# Altium schematic sheet schematic.SchDoc
size A4; SheetNumber: 1; SheetTotal: 1
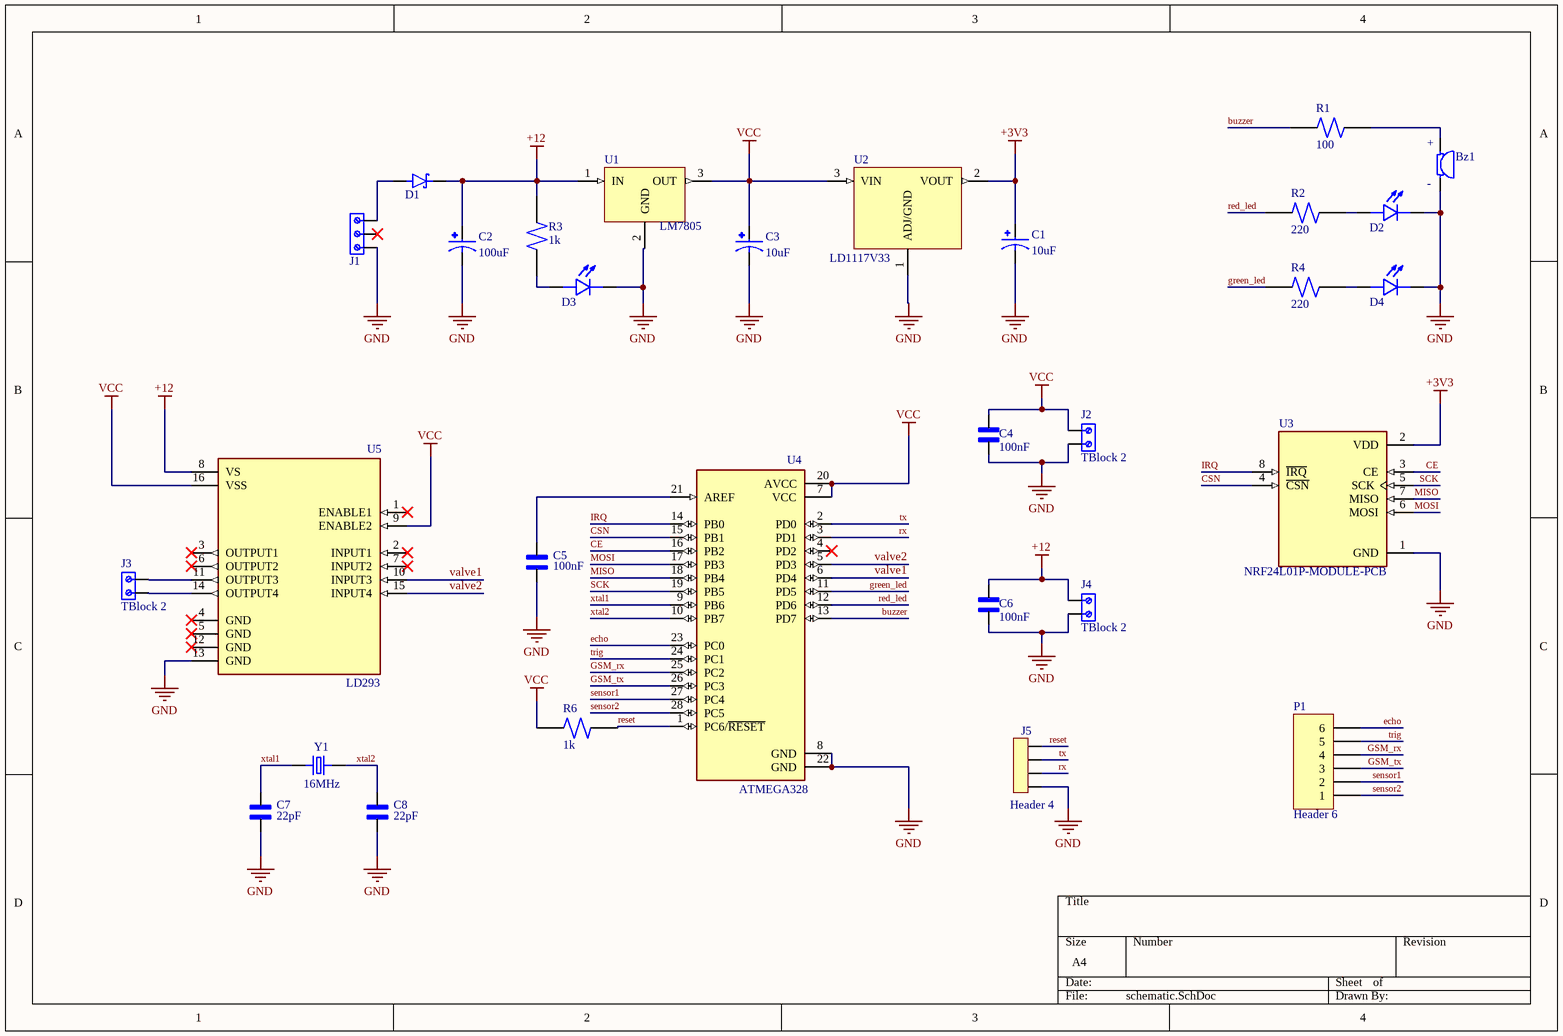
[diagram p0: schematic.SchDoc]

## Parts
Bz1  AI-1223-TWT-12V-R  [XDCR_AI-1223-TWT-12V-R]  (value not drawn)
C1  10uF  [CAPPRD500W50D500H1100]
C2  100uF  [CAPPRD500W50D500H1100]
C3  10uF  [CAPPRD500W50D500H1100]
C4  100nF  [CAPRB500W50L450T300H550]
C5  100nF  [CAPRB500W50L450T300H550]
C6  100nF  [CAPRB500W50L450T300H550]
C7  22pF  [CAPRB500W50L450T300H550]
C8  22pF  [CAPRB500W50L450T300H550]
D1  1N5404  [DIOAD1990W125L900D530]  (value not drawn)
D2  L08R5000Q1  [LEDRD254W57D500H1070]  (value not drawn)
D3  L08R5000Q1  [LEDRD254W57D500H1070]  (value not drawn)
D4  L08R5000Q1  [LEDRD254W57D500H1070]  (value not drawn)
J1  691214110003  [691214110003]  (value not drawn)
J2  TBlock 2  [691111710002]
J3  TBlock 2  [691111710002]
J4  TBlock 2  [691111710002]
J5  Header 4  [SULLINS_PPTC041LFBN-RC]
P1  Header 6  [HDR1X6]
R1  100  [RESAD1100W55L680D260]
R2  220  [RESAD1100W55L680D260]
R3  1k  [RESAD1100W55L680D260]
R4  220  [RESAD1100W55L680D260]
R6  1k  [RESAD1100W55L680D260]
U1  LM7805  [TO254P1054X470X1955-3]
U2  LD1117V33  [TO255P1020X450X1968-3]
U3  NRF24L01P-MODULE-PCB  [XCVR_NRF24L01P-MODULE-PCB]
U4  ATMEGA328  [DIP794W46P254L2967H457Q28B]
U5  LD293  [DIP880W50P254L2000H510Q16]
Y1  16MHz  [XTAL_ECS-160-20-4X]

## Nets
+3V3: C1.P U2.2(VOUT) U3.2(VDD)
+12: C2.P C6.2 D1.C(K) J4.2 R3.2 U1.1(IN) U5.8(VS)
GND: Bz1.N(NEG) C1.N C2.N C3.N C4.1 C5.1 C6.1 C7.1 C8.1 D2.C D3.C D4.C J1.1 J2.1 J4.1 J5.4 U1.2(GND) U2.1(ADJ/GND) U3.1(GND) U4.8(GND) U4.22(GND) U5.13(GND)
VCC: C3.P C4.2 J2.2 R6.2 U1.3(OUT) U2.3(VIN) U4.7(VCC) U4.20(AVCC) U5.9(ENABLE2) U5.16(VSS)
buzzer: R1.2 U4.13(PD7)
CE: U3.3(CE) U4.16(PB2)
CSN: U3.4(~{CSN}) U4.15(PB1)
echo: P1.6 U4.23(PC0)
green_led: R4.2 U4.11(PD5)
GSM_rx: P1.4 U4.25(PC2)
GSM_tx: P1.3 U4.26(PC3)
IRQ: U3.8(~{IRQ}) U4.14(PB0)
MISO: U3.7(MISO) U4.18(PB4)
MOSI: U3.6(MOSI) U4.17(PB3)
red_led: R2.2 U4.12(PD6)
reset: J5.1 R6.1 U4.1(PC6/~{RESET})
rx: J5.3 U4.3(PD1)
SCK: U3.5(SCK) U4.19(PB5)
sensor1: P1.2 U4.27(PC4)
sensor2: P1.1 U4.28(PC5)
trig: P1.5 U4.24(PC1)
tx: J5.2 U4.2(PD0)
valve1: U4.6(PD4) U5.10(INPUT3)
valve2: U4.5(PD3) U5.15(INPUT4)
xtal1: C7.2 U4.9(PB6) Y1.1
xtal2: C8.2 U4.10(PB7) Y1.2
NetBz1_P: Bz1.P(POS) R1.1
NetC5_2: C5.2 U4.21(AREF)
NetD1_A: D1.A J1.3
NetD2_A: D2.A R2.1
NetD3_A: D3.A R3.1
NetD4_A: D4.A R4.1
NetJ3_1: J3.1 U5.11(OUTPUT3)
NetJ3_2: J3.2 U5.14(OUTPUT4)

Not connected (* = marked no-connect by the designer): J1 2*; U4 4(PD2)*; U5 1(ENABLE1)* 2(INPUT1)* 3(OUTPUT1)* 4(GND)* 5(GND)* 6(OUTPUT2)* 7(INPUT2)* 12(GND)*

## Notes on the sheet
- (in symbol Buzzer) +; -

## Library data of the parts
Bz1 = Buzzer: ELECTRO-MECHANICAL AUDIO INDICATOR; MF: PUI Audio,; Availability: In Stock; Package: 2225 PUI Audio; Value: *; Price: None; MP: AI-1223-TWT-12V-R; Purchase-URL: https://pricing.snapeda.com/search/part/AI-1223-TWT-12V-R/?ref=eda
C1-C3 = Electrolytic capacitor: FS-A; MF: {'manufacturer': u'Panasonic'}; MP: EEUFS0J221B; Package: None; Value: *; Availability: Unavailable; Price: None
C4-C8 = Ceramic capacitor: 2200 pF Â±10% 250V Ceramic Capacitor X7R Radial; MF: TDK; MP: FG24X7R2E222KNT06; Digi-Key_Part_Number: 445-173386-1-ND; Purchase-URL: https://pricing.snapeda.com/search/part/FG24X7R2E222KNT06/?ref=eda; Check_prices: https://www.snapeda.com/parts/FG24X7R2E222KNT06/TDK/view-part/?ref=eda; Value: *; Package: Radial TDK; SnapEDA_Link: https://www.snapeda.com/parts/FG24X7R2E222KNT06/TDK/view-part/?ref=snap
D1 = Schrotic diode: Diode Standard 400 V 3A Through Hole DO-201AD; MF: ON Semiconductor; Purchase-URL: https://pricing.snapeda.com/search/part/1N5404/?ref=eda; Price: None; Check_prices: https://www.snapeda.com/parts/1N5404/Onsemi/view-part/?ref=eda; MP: 1N5404; Value: *; Package: AXIAL LEAD-2 ON Semiconductor; SnapEDA_Link: https://www.snapeda.com/parts/1N5404/Onsemi/view-part/?ref=snap; Availability: In Stock
D2-D4 = LED: LED, Orange, Through Hole, T-1 3/4 (5mm), 30 mA, 2.1 V, 635 nm; MF: {'manufacturer': u'LED Technology'}; Price: None; Package: None; Availability: Unavailable; MP: L08R5000Q1; Value: *
J1 = Terminal blocks - 3Pins (Small): 3 Position Wire to Board Terminal Block Horizontal with Board 0.138 (3.50mm) Through Hole; MF: Wurth Elektronik; Price: None; SnapEDA_Link: https://www.snapeda.com/parts/691214110003/Wurth+Elektronik/view-part/?ref=snap; Purchase-URL: https://pricing.snapeda.com/search/part/691214110003/?ref=eda; Availability: In Stock; MP: 691214110003; Package: None; Check_prices: https://www.snapeda.com/parts/691214110003/Wurth+Elektronik/view-part/?ref=eda; Value: *
J2-J4 = Terminal Block - 2Pins: 2 Position Wire to Board Terminal Block Horizontal with Board 0.197 _5.00mm_ Through Hole; MF: Wurth Electronics; Value: *; Availability: Unavailable; MP: 691111710002; Price: None; Package: None; SnapEDA_Link: https://www.snapeda.com/parts/691111710002/Wurth%20Electronics%20Inc./view-part/1195092/?ref=snap
J5 = Female header - 4Pins: 4 Position Header Connector Through Hole; MP: PPTC041LFBN-RC; MF: Sullins Connector; Value: *; SnapEDA_Link: https://www.snapeda.com/parts/PPTC041LFBN-RC/Sullins%20Connector%20Solutions/view-part/285917/?ref=snap; Package: None; Availability: Warning; Check_prices: https://www.snapeda.com/parts/PPTC041LFBN-RC/Sullins%20Connector%20Solutions/view-part/285917/?ref=eda; Price: None; Purchase-URL: https://pricing.snapeda.com/search/part/PPTC041LFBN-RC/?ref=eda
P1 = Header 6: Header, 6-Pin; LatestRevisionDate: 17-Jul-2002; LatestRevisionNote: Re-released for DXP Platform.; Publisher: Altium Limited
R1-R4 R6 = Resistor (0.25W): (MFR-25FBF52-10K) 10,2 kOhm bei 1% 0,25W, 1/4W Durchbohrlochwiderstand Axial Metal Film; MF: Yageo; Digi-Key_Part_Number: 10.2KXBK-ND; SnapEDA_Link: https://www.snapeda.com/parts/MFR-25FBF52-10K/Yageo/view-part/424333/?ref=snap; Package: Axial Yageo; Purchase-URL: https://pricing.snapeda.com/search/part/MFR-25FBF52-10K/?ref=eda; MP: MFR-25FBF52-10K; Value: *
U1 = LM7805CT/NOPB: Price: None; MP: LM7805CT/NOPB; Value: *; Availability: Unavailable; Package: None
U3 = NRF24L01P-MODULE-PCB: - Transceiver For Use With nRF24L01+; MF: Nordic Semiconductor; Package: None; MP: NRF24L01P-MODULE-PCB; Value: *; Availability: Bad; Price: None; SnapEDA_Link: https://www.snapeda.com/parts/NRF24L01P-MODULE-PCB/Nordic%20Semiconductor%20ASA/view-part/230534/?ref=snap; Mouser-Purchase-URL: https://snapeda.com/shop?store=Mouser&id=230534
U4 = ATMEGA328P-PU: ATmega Series 20 MHz 32 KB Flash 2 KB SRAM 8-Bit Microcontroller - DIP-28; Value: *; MP: ATMEGA328P-PU; Package: None; Availability: Unavailable; Price: None
U5 = L293D: 4-Channel Motor Driver 24V 16-Pin Power PDIP Tube; Price: None; Package: None; Availability: Unavailable; MP: L293D; Value: *
Y1 = Crystal oscilator: CRYSTAL T/H; MF: {'manufacturer': u'ECS Inc.'}; MP: ECS-160-S-4; Package: None; Value: *; Availability: Unavailable; Price: None
U2 = LD1117V33: Package: None; MP: LD1117V33; Price: None; Availability: Unavailable; Value: *